# EAGLE design ind_cntrl (EAGLE 9.2.2)
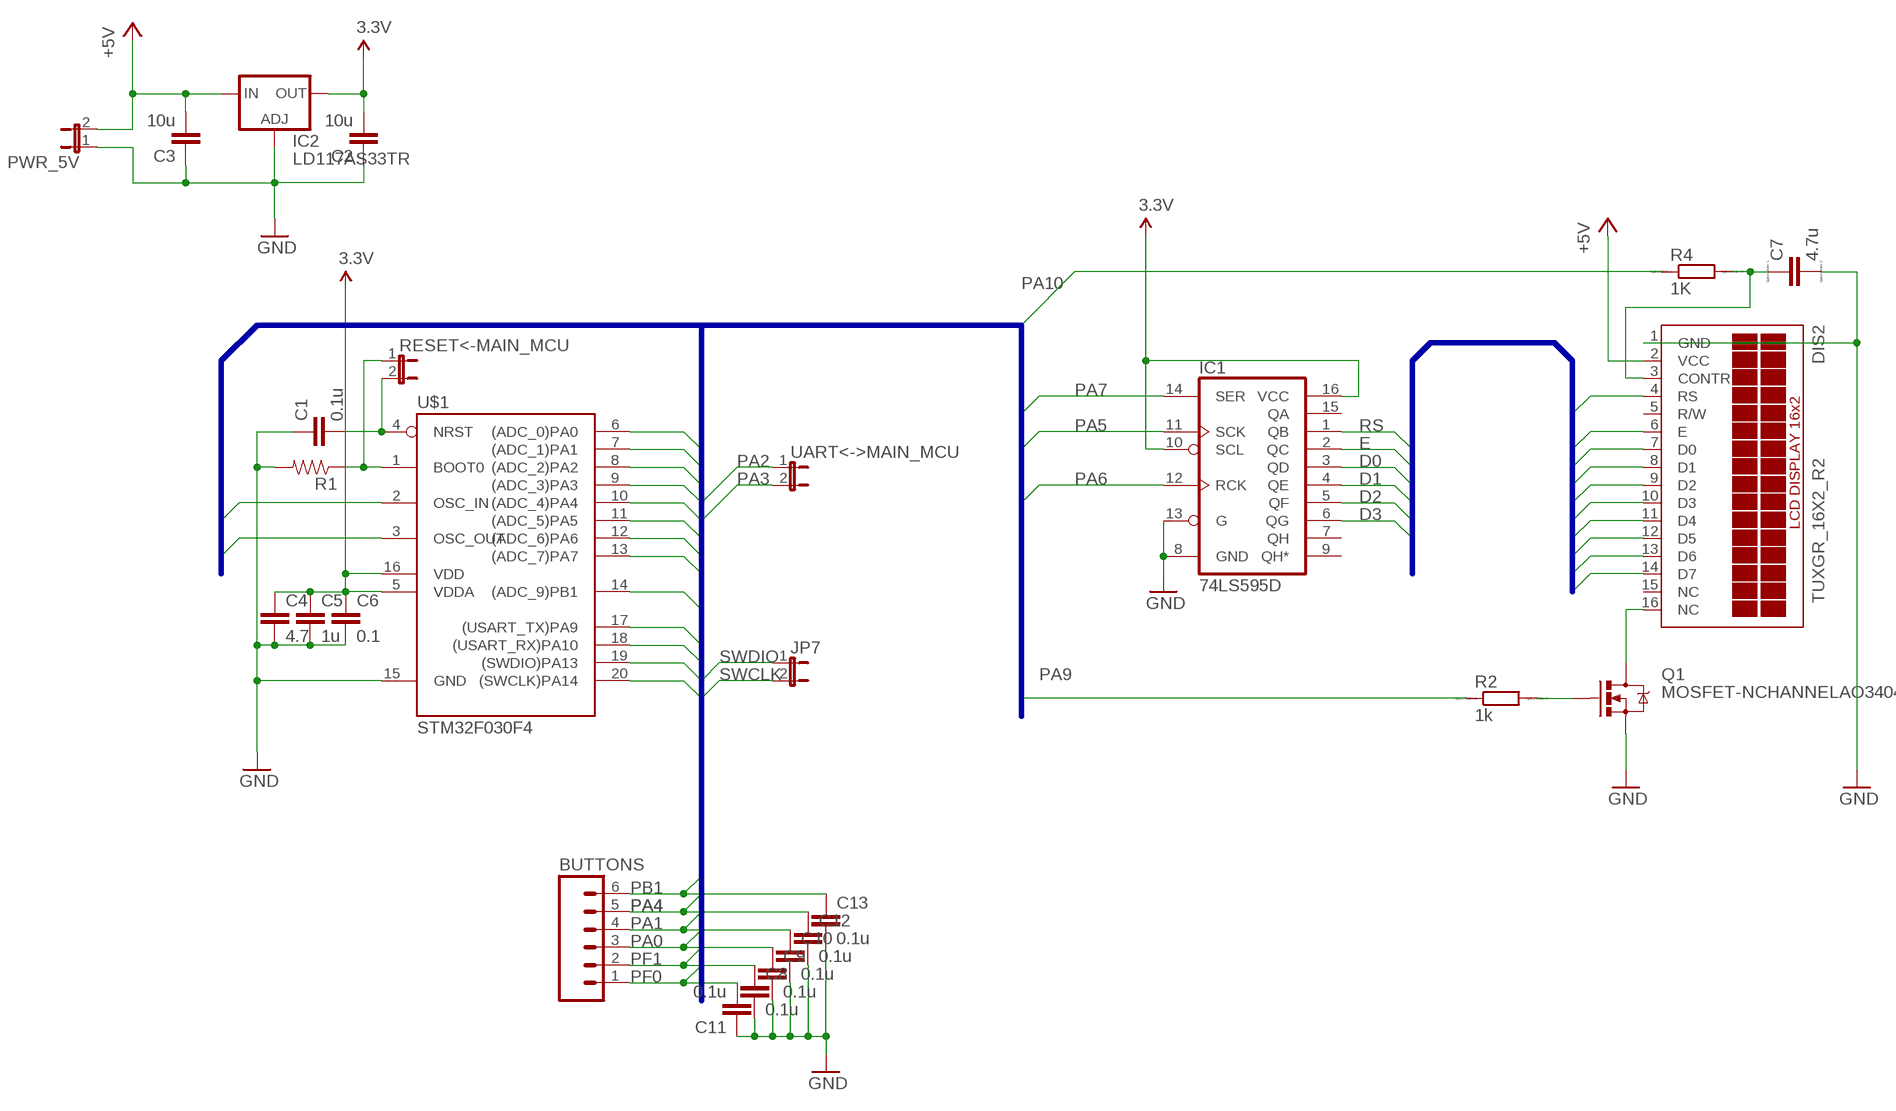
[diagram p0: schematic, sheet 1]

## Parts
BUTTONS  M06  [06P]
C1  0.1u  CAP0805  [0805]
C2  10u  CAP0805  [0805]
C3  10u  CAP0805  [0805]
C4  4.7  CAP0805  [0805]
C5  1u  CAP0805  [0805]
C6  0.1  CAP0805  [0805]
C7  4.7u  C-EUC1206  [C1206]
C8  0.1u  CAP0805  [0805]
C9  0.1u  CAP0805  [0805]
C10  0.1u  CAP0805  [0805]
C11  0.1u  CAP0805  [0805]
C12  0.1u  CAP0805  [0805]
C13  0.1u  CAP0805  [0805]
DIS2  TUXGR_16X2_R2  [TUXGR_16X2_R2]
IC1  74LS595D  [SO16]
IC2  LD117AS33TR  [SOT223]
JP7  JP1E  [JP1]
PWR_5V  JP1E  [JP1]
Q1  MOSFET-NCHANNELAO3404A  [SOT23-3]
R1  RESISTOR0805-RES  [0805]
R2  1k  R-EU_R0805  [R0805]
R4  1K  R-EU_R0805  [R0805]
RESET<-MAIN_MCU  JP1E  [JP1]
U$1  STM32F030F4  [2QSP20]
UART<->MAIN_MCU  JP1E  [JP1]

## Nets
3.3V: C2.2 C4.1 C5.1 C6.1 IC1.10(SCL) IC1.16(VCC) IC2.4(OUT) U$1.5(VDDA) U$1.16(VDD)
+5V: C3.2 DIS2.2(VCC) IC2.3(IN) PWR_5V.2
D0: DIS2.7(D0) IC1.3(QD)
D1: DIS2.8(D1) IC1.4(QE)
D2: DIS2.9(D2) IC1.5(QF)
D3: DIS2.10(D3) IC1.6(QG)
D4: DIS2.11(D4)
D5: DIS2.12(D5)
D6: DIS2.13(D6)
D7: DIS2.14(D7)
E: DIS2.6(E) IC1.2(QC)
GND: C1.1 C2.1 C3.1 C4.2 C5.2 C6.2 C7.2 C8.2 C9.2 C10.2 C11.1 C12.2 C13.2 DIS2.1(GND) IC1.8(GND) IC1.13(G) IC2.1(ADJ) PWR_5V.1 Q1.2(S) R1.2 U$1.15(GND)
N$1: C1.2 RESET<-MAIN_MCU.2 U$1.4(NRST)
N$2: R1.1 RESET<-MAIN_MCU.1 U$1.1(BOOT0)
N$5: C7.1 DIS2.3(CONTR) R4.2
N$18: Q1.1(G) R2.2
N$22: DIS2.16(NC) Q1.3(D)
PA0: BUTTONS.3 C9.1 U$1.6((ADC_0)PA0)
PA1: BUTTONS.4 C10.1 U$1.7((ADC_1)PA1)
PA2: U$1.8((ADC_2)PA2) UART<->MAIN_MCU.1
PA3: U$1.9((ADC_3)PA3) UART<->MAIN_MCU.2
PA4: BUTTONS.5 C12.1 U$1.10((ADC_4)PA4)
PA5: IC1.11(SCK) U$1.11((ADC_5)PA5)
PA6: IC1.12(RCK) U$1.12((ADC_6)PA6)
PA7: IC1.14(SER) U$1.13((ADC_7)PA7)
PA9: R2.1 U$1.17((USART_TX)PA9)
PA10: R4.1 U$1.18((USART_RX)PA10)
PB1: BUTTONS.6 C13.1 U$1.14((ADC_9)PB1)
PF0: BUTTONS.1 C11.2 U$1.2(OSC_IN)
PF1: BUTTONS.2 C8.1 U$1.3(OSC_OUT)
RS: DIS2.4(RS) IC1.1(QB)
SWCLK: JP7.2 U$1.20((SWCLK)PA14)
SWDIO: JP7.1 U$1.19((SWDIO)PA13)
Unconnected: DIS2.5(R/W) DIS2.15(NC) IC1.7(QH) IC1.9(QH*) IC1.15(QA)

## Buses
PA[0..7],PB1,PA[9..10],SWDIO,SWCLK,PF0,PF1
RS,E,D[0..7]

## Library data of the parts
BUTTONS = con-amp-quick:M06: AMP QUICK CONNECTOR; OC_FARNELL: unknown; OC_NEWARK: unknown
C1-C6 C8-C13 = SparkFun-Capacitors:CAP: Capacitor Standard 0603 ceramic capacitor, and 0.1" leaded capacitor.
C7 = resistor:C-EU: CAPACITOR, European symbol; SPICEPREFIX: C
DIS2 = display-lcd:TUXGR_16X2_R2: Tuxgraphics LCD display 16x2 characters reflective, without background light Source: tuxgr_12x2_r2.pdf; OC_FARNELL: unknown; OC_NEWARK: unknown
IC1 = SparkFun-DigitalIC:74*595: 8-bit SHIFT REGISTER, output latch; PROD_ID: IC-07875
IC2 = v-reg:LD117A?*: Low drop fixed and adjustable positive voltage regulators 1 A Source: http://www.st.com/stonline/products/literature/ds/7194/ld1117axx.pdf
JP7 PWR_5V RESET<-MAIN_MCU UART<->MAIN_MCU = jumper:JP1E: JUMPER
Q1 = SparkFun-DiscreteSemi:MOSFET-NCHANNEL: Common NMOSFET Parts MFG P/N Store ID Prod ID FDD8780 TRANS-09984 SI7820DN TRANS-11055 FDS6630A IC-08089 2N7002PW TRANS-11151 FQP30N06L COM-10213 TRANS-10060 BSS123LT1G TRANS-08345 BSS138 TRANS-00830 BS170 2N7000; PROD_ID: TRAN-12988
R1 = SparkFun-Resistors:RESISTOR: Resistor Basic schematic elements and footprints for 0603, 1206, and PTH resistors.
R2 R4 = resistor:R-EU_: RESISTOR, European symbol; SPICEPREFIX: R
U$1 = stm32:STM32F030F4: ARM Cortex-M0 MCU 16 Kbytes Flash, 4 kbytes SRAM, 48 MHz, 2.4 - 3.6 V

## Board
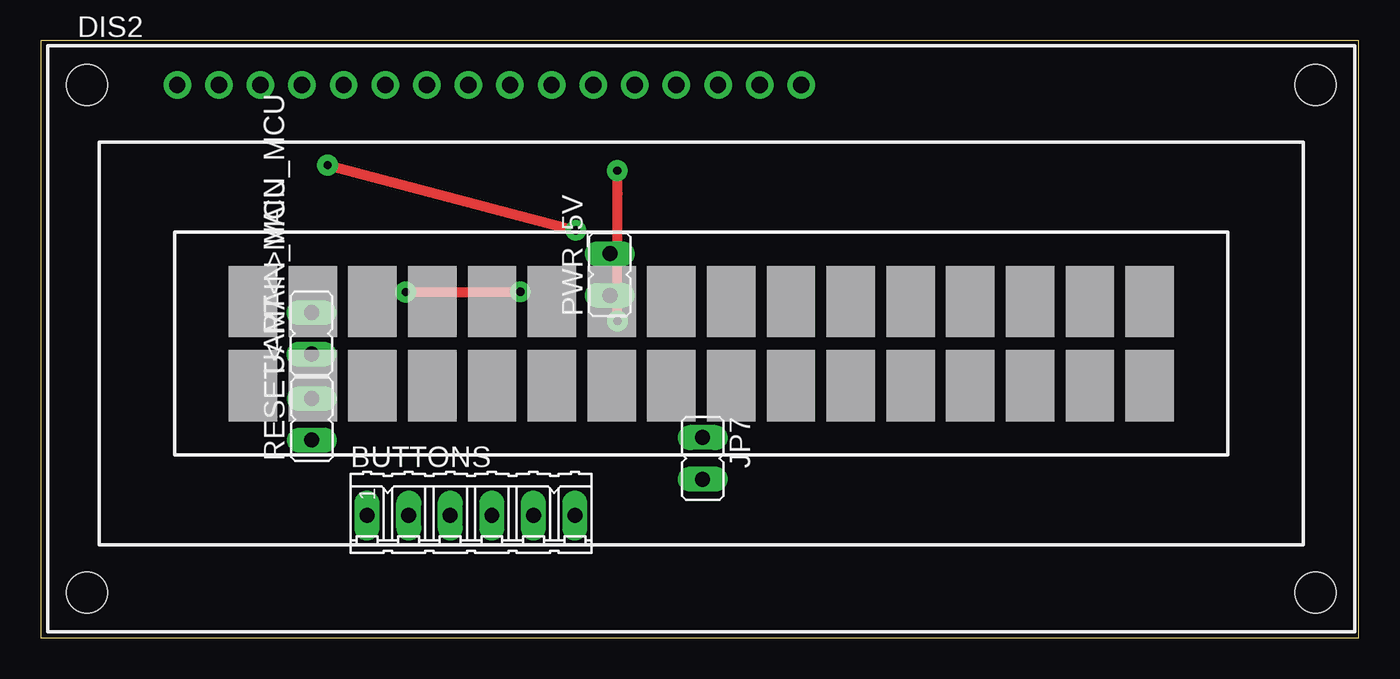
[diagram p1: board, top side]
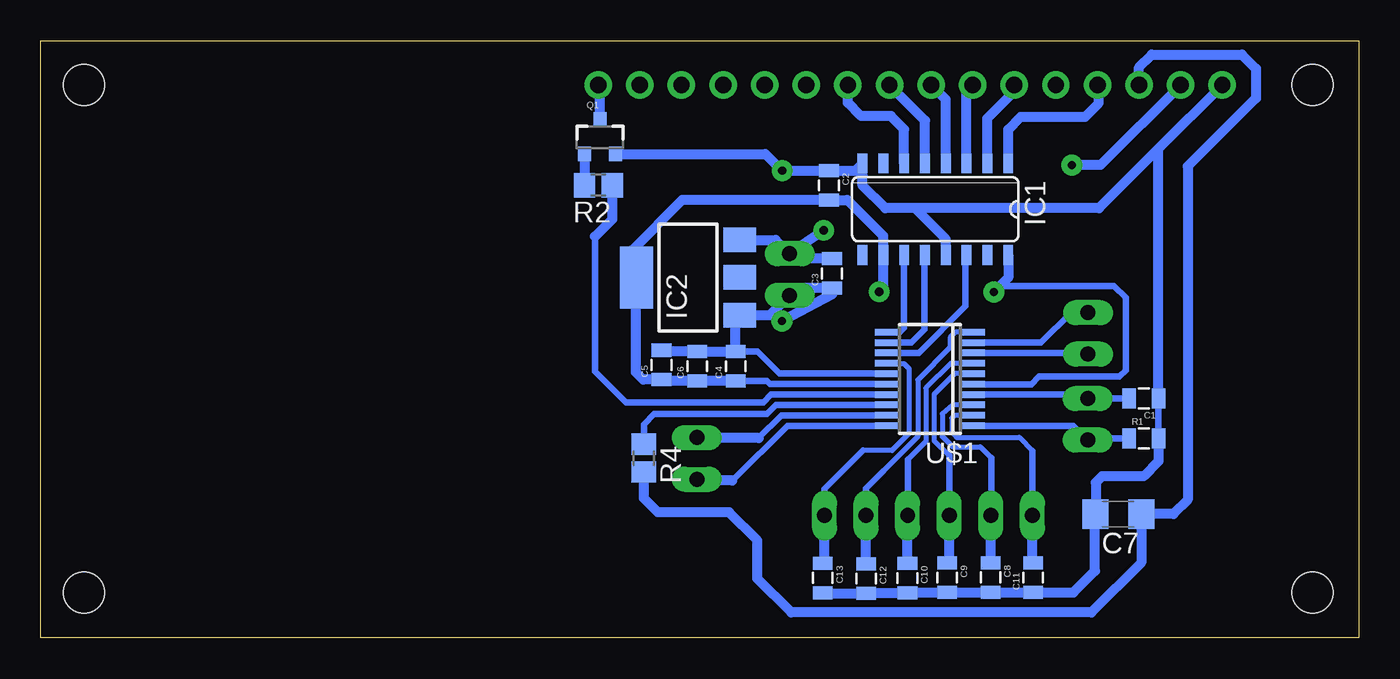
[diagram p2: board, bottom side, seen from below]

Size 80.45 x 36.46 mm. Coordinates in mm from the lower left corner, seen from the top.
Outline: 0,0 80.45,0 80.45,36.46 0,36.46 0,0
Copper layers (1*16): Top 0.035mm / dielectric 1.5mm / Bottom 0.035mm
Design rules "SparkFun": minimum track width 8mil, minimum drill 20mil, track to track 8mil, track to pad 8mil, pad to pad 8mil, via to via 8mil, smd to smd 8mil, copper to edge 10mil, drill to drill 8mil, minimum pad ring 12mil, minimum via ring 10mil, stop-mask expansion 4mil, vias tented up to drill 25mil, thermal gap 10mil

### Footprints (pad centres in the part's own frame; a part is rotated, then mirrored left to right if it is on the bottom)
06P = drill 0.914 long: 1 -6.35,0; 2 -3.81,0; 3 -1.27,0; 4 1.27,0; 5 3.81,0; 6 6.35,0
0805 = smd 0.8 x 1.2: 1 -0.9,0; 2 0.9,0
C1206 = smd 1.6 x 1.8: 1 -1.4,0; 2 1.4,0
TUXGR_16X2_R2 = drill 1 pad 1.676: 1 -32,15.5; 2 -29.46,15.5; 3 -26.92,15.5; 4 -24.38,15.5; 5 -21.84,15.5; 6 -19.3,15.5; 7 -16.76,15.5; 8 -14.22,15.5; 9 -11.68,15.5; 10 -9.14,15.5; 11 -6.6,15.5; 12 -4.06,15.5; 13 -1.52,15.5; 14 1.02,15.5; 15 3.56,15.5; 16 6.1,15.5 | hole 2.5: -37.5,-15.5; 37.5,-15.5; -37.5,15.5; 37.5,15.5
SO16 = smd 0.6 x 1.2: 1 -4.445,-2.8; 2 -3.175,-2.8; 3 -1.905,-2.8; 4 -0.635,-2.8; 5 0.635,-2.8; 6 1.905,-2.8; 7 3.175,-2.8; 8 4.445,-2.8; 9 4.445,2.8; 10 3.175,2.8; 11 1.905,2.8; 12 0.635,2.8; 13 -0.635,2.8; 14 -1.905,2.8; 15 -3.175,2.8; 16 -4.445,2.8
SOT223 = smd 1.5 x 2: 1 -2.3,-3.15; 2 0,-3.15; 3 2.3,-3.15 | smd 3.8 x 2: 4 0,3.15
JP1 = drill 0.914 long: 1 0,-1.27; 2 0,1.27
SOT23-3 = smd 0.8 x 0.9: 1 -0.95,-1; 2 0.95,-1; 3 0,1.1
R0805 = smd 1.3 x 1.5: 1 -0.85,0; 2 0.85,0
2QSP20 = smd 0.4 x 1.5: 1 -2.223,-2.6; 2 -1.588,-2.6; 3 -0.953,-2.6; 4 -0.318,-2.6; 5 0.318,-2.6; 6 0.953,-2.6; 7 1.588,-2.6; 8 2.223,-2.6; 9 2.858,-2.6; 10 3.493,-2.6; 11 3.493,2.6; 12 2.858,2.6; 13 2.223,2.6; 14 1.588,2.6; 15 0.953,2.6; 16 0.318,2.6; 17 -0.318,2.6; 18 -0.953,2.6; 19 -1.588,2.6; 20 -2.223,2.6

### Placement (x,y rotation side)
BUTTONS  26.26,7.47 0 top
C1  13.11,14.62 180 bottom
C2  32.34,27.64 270 bottom
C3  32.15,22.26 90 bottom
C4  38.03,16.59 90 bottom
C5  42.56,16.67 90 bottom
C6  40.37,16.59 90 bottom
C7  14.67,7.56 180 bottom
C8  22.47,3.69 270 bottom
C9  25.12,3.68 270 bottom
C10  27.54,3.65 270 bottom
C11  19.87,3.68 90 bottom
C12  30.06,3.62 270 bottom
C13  32.71,3.66 270 bottom
DIS2  40.32,18.27 0 top
IC1  25.84,26.18 180 bottom
IC2  40.94,22.01 90 bottom
JP7  40.4,10.96 180 top
PWR_5V  34.74,22.19 0 top
Q1  46.32,30.56 0 bottom
R1  13.11,12.18 0 bottom
R2  46.41,27.65 180 bottom
R4  43.64,10.98 270 bottom
RESET<-MAIN_MCU  16.54,13.35 0 top
U$1  26.17,15.18 90 bottom
UART<->MAIN_MCU  16.52,18.6 0 top

### Tracks (layer width: path | path; a pad name or v marks a point on that pad's centre or on a via)
3.3V  (via drill 0.5 pad 1.27)
  Top 0.61: v22.27,21.12 29.25,21.12 v29.27,21.14
  Bottom 0.4: 14.21,20.78 14.93,21.5 21.89,21.5
  Bottom 0.406: U$1.16 35.93,15.5 36.12,15.69 C4.1 | 14.21,20.78 14.21,16.34 14.6,15.95 19.52,15.95 19.99,15.48 23.55,15.48 U$1.5
  Bottom 0.61: C4.1 C6.1 42.48,15.69 C5.1 43.68,15.77 44.13,16.22 44.13,21.97 IC2.4 44.37,22.06 44.37,23.67 41.3,26.74 C2.2 31.21,26.74 29.04,24.57 29.04,23.41 IC1.10 29.02,21.39 v29.27,21.14 | IC1.16 21.39,22 21.89,21.5 v22.27,21.12
+5V  (via drill 0.5 pad 1.27)
  Top 0.61: v17.51,28.88 v32.66,24.89
  Bottom 0.61: IC2.3 35.59,24.31 PWR_5V.2 | C3.2 34.44,23.16 PWR_5V.2 | DIS2.2 15.75,28.88 v17.51,28.88 | v32.66,24.89 PWR_5V.2
D0
  Bottom 0.61: IC1.3 23.93,33.4 DIS2.7
D1
  Bottom 0.61: IC1.4 25.2,32.88 DIS2.8
D2
  Bottom 0.61: IC1.5 26.48,31.61 DIS2.9
D3
  Bottom 0.61: IC1.6 27.75,31.07 28.55,31.87 30.37,31.87 31.18,32.68 DIS2.10
E
  Bottom 0.61: IC1.2 22.66,31.73 21.02,33.38 DIS2.6
GND  (via drill 0.5 pad 1.27)
  Top 0.61: v35.2,19.35 35.22,27.12 v35.19,28.53
  Bottom 0.406: U$1.15 35.36,16.13 36.71,17.48 C4.2 | R1.2 C1.1
  Bottom 0.61: 30.66,28.61 30.73,28.54 C2.1 v35.19,28.53 36.22,29.56 Q1.2 | 30.66,28.61 IC1.8 | IC1.13 25.2,24.34 27.1,26.24 | 27.1,26.24 28.9,26.24 30.28,27.62 30.28,28.23 30.66,28.61 | C1.1 12.21,29.88 | 12.21,29.88 DIS2.1 | 12.21,29.88 15.85,26.24 27.1,26.24 | v35.2,19.35 32.15,20.98 C3.1 34.3,21.36 PWR_5V.1 35.95,19.71 IC2.1 38.03,19.47 C4.2 C6.2 42.48,17.49 C5.2 | C13.2 32.67,2.72 C12.2 30.03,2.75 C10.2 27.51,2.78 C9.2 C8.2 C11.1 17.4,2.78 16.09,4.09 16.09,7.54 C7.2 16.05,7.58 16.05,9.48 15.66,9.87 13.12,9.87 12.21,10.78 R1.2
N$1
  Bottom 0.406: U$1.4 16.78,14.86 RESET<-MAIN_MCU.2 | 16.51,14.59 RESET<-MAIN_MCU.2 | C1.2 RESET<-MAIN_MCU.2
N$2
  Bottom 0.406: U$1.1 17.42,12.96 RESET<-MAIN_MCU.1 16.44,12.18 R1.1
N$5
  Bottom 0.61: DIS2.3 13.4,34.85 12.63,35.62 7.12,35.62 6.27,34.77 6.27,32.96 10.43,28.8 10.43,8.43 11.3,7.56 C7.1 13.27,4.59 16.31,1.55 34.64,1.55 36.71,3.62 36.71,5.95 38.43,7.67 42.78,7.67 43.64,8.53 R4.2
N$18
  Bottom 0.61: Q1.1 R2.2
N$22
  Bottom 0.61: Q1.3 46.32,33.67 DIS2.16
PA0
  Bottom 0.305: U$1.6 24.65,16.13 25.72,15.07 25.92,14.87 25.92,12.05 24.99,11.13 | BUTTONS.3
  Bottom 0.406: 24.99,11.13 BUTTONS.3
  Bottom 0.61: C9.1 24.99,4.71 BUTTONS.3
PA1
  Bottom 0.305: U$1.7 24.89,16.77 26.42,15.25 26.41,12.01 27.52,10.91 | 27.51,7.5 BUTTONS.4
  Bottom 0.406: 27.52,10.91 27.51,7.5
  Bottom 0.61: C10.1 BUTTONS.4
PA2
  Bottom 0.406: U$1.8 16.59,17.4 UART<->MAIN_MCU.1
PA3
  Bottom 0.406: U$1.9 19.39,18.04 17.55,19.88 UART<->MAIN_MCU.2
PA4
  Bottom 0.305: U$1.10 24.61,18.67 24.95,18.33 24.95,17.72 26.91,15.76 26.91,12.3 29.04,10.16
  Bottom 0.406: 29.04,10.16 30.07,9.13 BUTTONS.5
  Bottom 0.61: C12.1 BUTTONS.5
PA5
  Bottom 0.406: U$1.11 28.01,18.67 27.76,18.92 27.76,23.36 IC1.11
PA6
  Bottom 0.406: U$1.12 27.3,18.04 26.5,18.84 26.5,23.36 IC1.12
PA7
  Bottom 0.406: U$1.13 26.85,17.4 23.99,20.26 23.99,23.32 IC1.14
PA9
  Bottom 0.406: U$1.17 35.87,14.86 36.34,14.39 44.73,14.39 46.62,16.28 46.62,24.51 | 45.6,27.61 R2.1
  Bottom 0.61: 46.62,24.51 45.56,25.57 R2.1
PA10
  Bottom 0.406: U$1.18 35.56,14.23 36.12,13.67 43.02,13.67 43.64,13.05 R4.1
PB1
  Bottom 0.305: U$1.14 27.75,16.75 27.44,16.45 27.44,12.49 28.49,11.44 30.27,11.44
  Bottom 0.406: 30.27,11.44 32.61,9.1 BUTTONS.6
  Bottom 0.61: C13.1 32.61,4.66 BUTTONS.6
PF0
  Bottom 0.305: U$1.2 24.67,13.59 24.83,13.43 24.83,12.59 24.56,12.25 20.72,12.25 19.93,11.41
  Bottom 0.406: 19.93,11.41 BUTTONS.1
  Bottom 0.61: C11.2 19.91,4.62 BUTTONS.1
PF1
  Bottom 0.305: U$1.3 24.75,14.23 25.42,13.68 25.42,12.3 24.84,11.73 24.79,11.69 24.76,11.67 23.09,11.67 22.42,11 | 22.43,7.53 BUTTONS.2
  Bottom 0.406: 22.42,11 22.43,7.53
  Bottom 0.61: C8.1 22.45,4.61 BUTTONS.2
RS
  Bottom 0.61: IC1.1 21.39,31.05 20.62,31.83 16.69,31.83 15.86,32.66 15.86,33.69 DIS2.4
SWCLK
  Bottom 0.406: U$1.20 34.88,12.96 38.23,9.61 | 40.32,9.61 JP7.2
  Bottom 0.61: 38.23,9.61 40.32,9.61
SWDIO
  Bottom 0.406: U$1.19 35.25,13.59 36.63,12.21 | 40.38,12.21 JP7.1
  Bottom 0.61: 36.63,12.21 40.38,12.21